# EAGLE design PressurePoints1X (EAGLE 9.2.0)
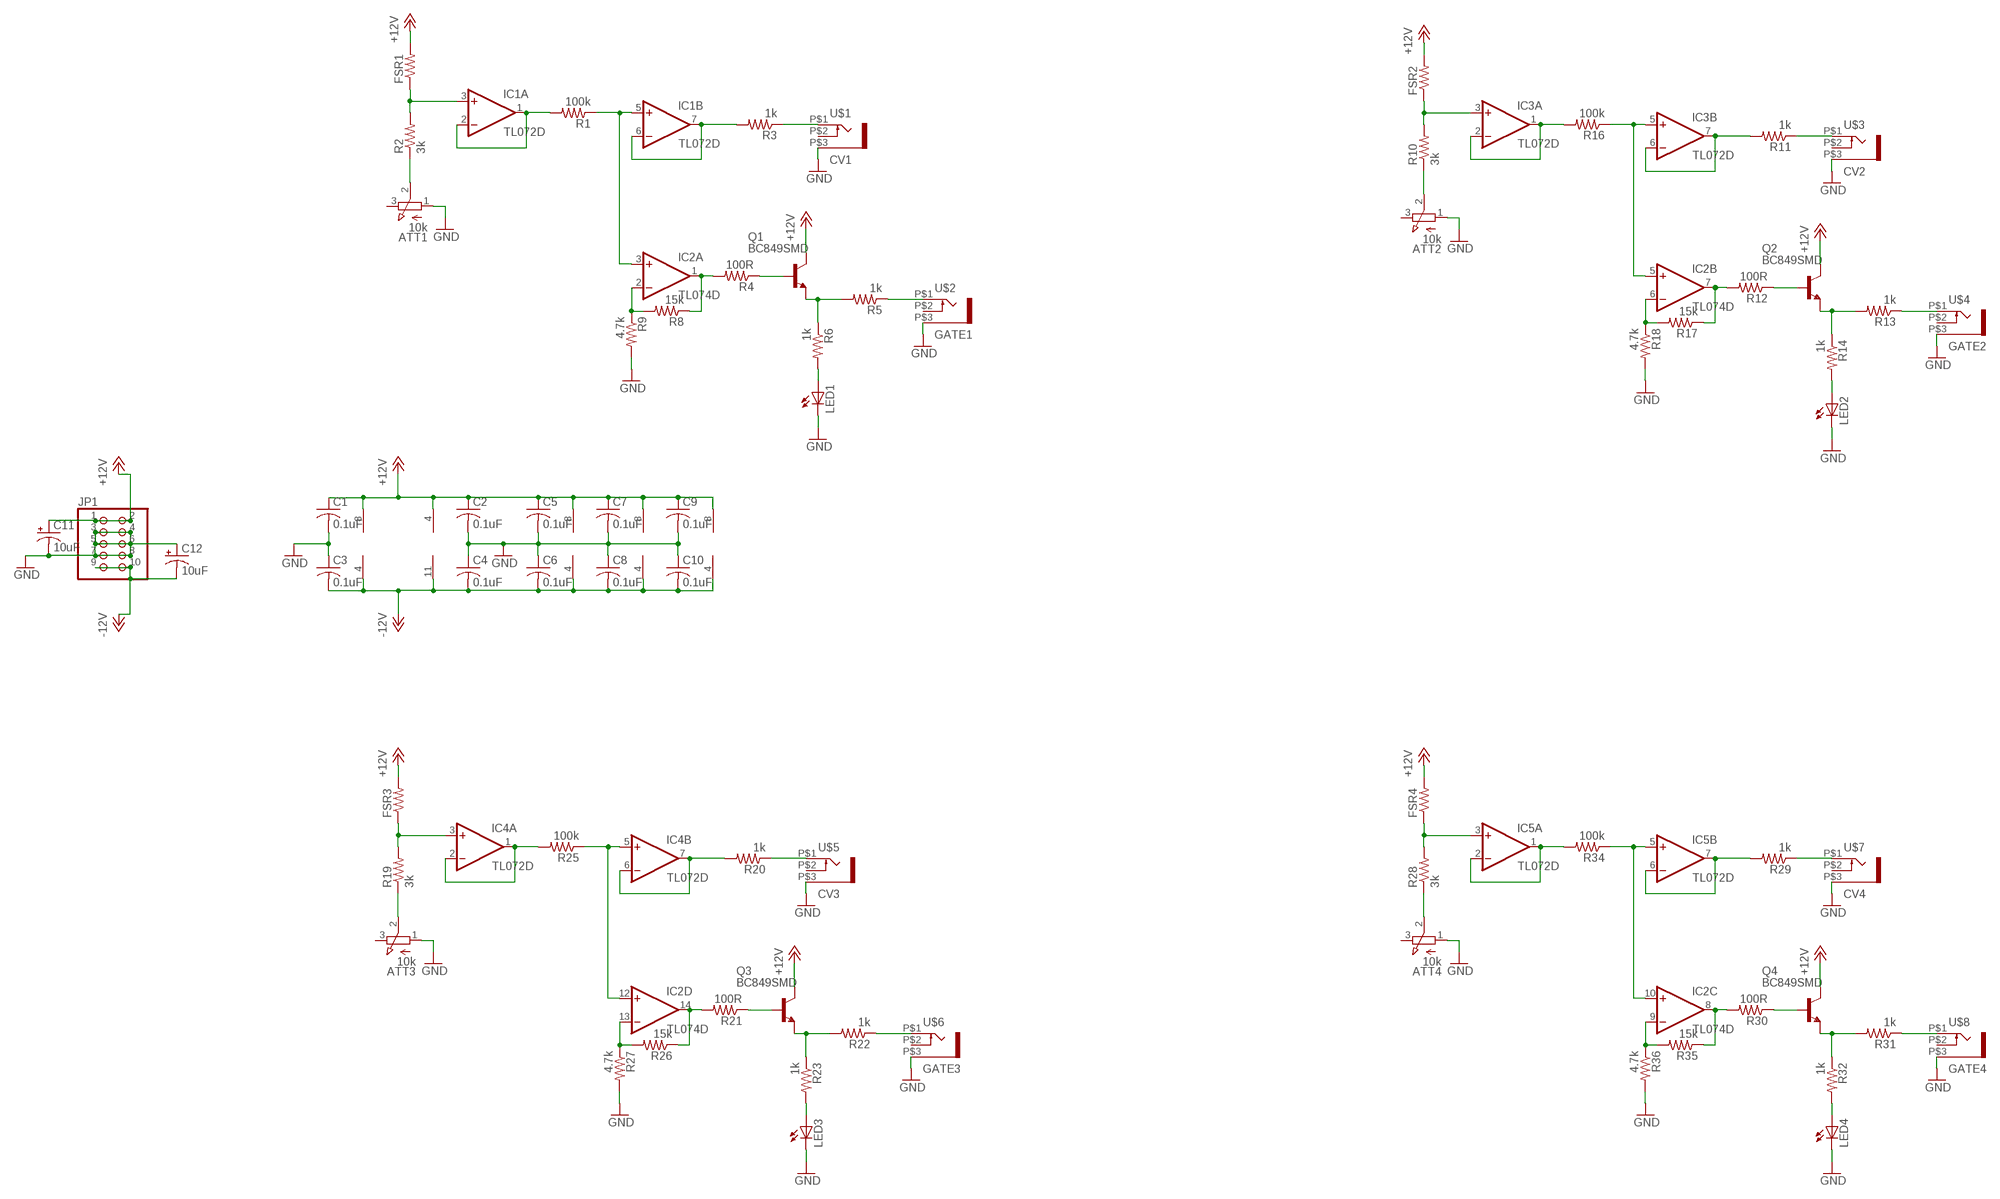
[diagram p0: schematic, sheet 1]

## Parts
ATT1  10k  EVUF2J  [EVUFXJ]
ATT2  10k  EVUF2J  [EVUFXJ]
ATT3  10k  EVUF2J  [EVUFXJ]
ATT4  10k  EVUF2J  [EVUFXJ]
C1  0.1uF  C-USC0603  [C0603]
C2  0.1uF  C-USC0603  [C0603]
C3  0.1uF  C-USC0603  [C0603]
C4  0.1uF  C-USC0603  [C0603]
C5  0.1uF  C-USC0603  [C0603]
C6  0.1uF  C-USC0603  [C0603]
C7  0.1uF  C-USC0603  [C0603]
C8  0.1uF  C-USC0603  [C0603]
C9  0.1uF  C-USC0603  [C0603]
C10  0.1uF  C-USC0603  [C0603]
C11  10uF  CPOL-USE2-5  [E2-5]
C12  10uF  CPOL-USE2-5  [E2-5]
FSR1  R-US_0207/2V  [0207/2V]
FSR2  R-US_0207/2V  [0207/2V]
FSR3  R-US_0207/2V  [0207/2V]
FSR4  R-US_0207/2V  [0207/2V]
IC1  TL072D  [SO08]
IC2  TL074D  [SO14]
IC3  TL072D  [SO08]
IC4  TL072D  [SO08]
IC5  TL072D  [SO08]
JP1  PINHD-2X5  [2X05]
LED1  LED3MM  [LED3MM]
LED2  LED3MM  [LED3MM]
LED3  LED3MM  [LED3MM]
LED4  LED3MM  [LED3MM]
Q1  BC849SMD  [SOT23-BEC]
Q2  BC849SMD  [SOT23-BEC]
Q3  BC849SMD  [SOT23-BEC]
Q4  BC849SMD  [SOT23-BEC]
R1  100k  R-US_R0603  [R0603]
R2  3k  R-US_R0603  [R0603]
R3  1k  R-US_R0603  [R0603]
R4  100R  R-US_R0603  [R0603]
R5  1k  R-US_R0603  [R0603]
R6  1k  R-US_R0603  [R0603]
R8  15k  R-US_R0603  [R0603]
R9  4.7k  R-US_R0603  [R0603]
R10  3k  R-US_R0603  [R0603]
R11  1k  R-US_R0603  [R0603]
R12  100R  R-US_R0603  [R0603]
R13  1k  R-US_R0603  [R0603]
R14  1k  R-US_R0603  [R0603]
R16  100k  R-US_R0603  [R0603]
R17  15k  R-US_R0603  [R0603]
R18  4.7k  R-US_R0603  [R0603]
R19  3k  R-US_R0603  [R0603]
R20  1k  R-US_R0603  [R0603]
R21  100R  R-US_R0603  [R0603]
R22  1k  R-US_R0603  [R0603]
R23  1k  R-US_R0603  [R0603]
R25  100k  R-US_R0603  [R0603]
R26  15k  R-US_R0603  [R0603]
R27  4.7k  R-US_R0603  [R0603]
R28  3k  R-US_R0603  [R0603]
R29  1k  R-US_R0603  [R0603]
R30  100R  R-US_R0603  [R0603]
R31  1k  R-US_R0603  [R0603]
R32  1k  R-US_R0603  [R0603]
R34  100k  R-US_R0603  [R0603]
R35  15k  R-US_R0603  [R0603]
R36  4.7k  R-US_R0603  [R0603]
U$1  CV1  WQP-PJ301M-12_JACK  [WQP-PJ301M-12_JACK]
U$2  GATE1  WQP-PJ301M-12_JACK  [WQP-PJ301M-12_JACK]
U$3  CV2  WQP-PJ301M-12_JACK  [WQP-PJ301M-12_JACK]
U$4  GATE2  WQP-PJ301M-12_JACK  [WQP-PJ301M-12_JACK]
U$5  CV3  WQP-PJ301M-12_JACK  [WQP-PJ301M-12_JACK]
U$6  GATE3  WQP-PJ301M-12_JACK  [WQP-PJ301M-12_JACK]
U$7  CV4  WQP-PJ301M-12_JACK  [WQP-PJ301M-12_JACK]
U$8  GATE4  WQP-PJ301M-12_JACK  [WQP-PJ301M-12_JACK]

## Nets
+12V: C1.1 C2.1 C5.1 C7.1 C9.1 C11.+ FSR1.2 FSR2.2 FSR3.2 FSR4.2 IC1.8(P:V+) IC2.4(P:V+) IC3.8(P:V+) IC4.8(P:V+) IC5.8(P:V+) JP1.1 JP1.2 Q1.C Q2.C Q3.C Q4.C
-12V: C3.2 C4.2 C6.2 C8.2 C10.2 C12.- IC1.4(P:V-) IC2.11(P:V-) IC3.4(P:V-) IC4.4(P:V-) IC5.4(P:V-) JP1.9 JP1.10
GND: ATT1.1(A) ATT2.1(A) ATT3.1(A) ATT4.1(A) C1.2 C2.2 C3.1 C4.1 C5.2 C6.1 C7.2 C8.1 C9.2 C10.1 C11.- C12.+ JP1.3 JP1.4 JP1.5 JP1.6 JP1.7 JP1.8 LED1.K(C) LED2.K(C) LED3.K(C) LED4.K(C) R9.2 R18.2 R27.2 R36.2 U$1.P$3 U$2.P$3 U$3.P$3 U$4.P$3 U$5.P$3 U$6.P$3 U$7.P$3 U$8.P$3
N$1: FSR1.1 IC1.3(A:+IN) R2.2
N$2: ATT1.2(S) R2.1
N$3: IC1.5(B:+IN) IC2.3(A:+IN) R1.1
N$4: IC1.6(B:-IN) IC1.7(B:OUT) R3.2
N$5: R3.1 U$1.P$1
N$6: Q1.E R5.2 R6.1
N$7: IC2.1(A:OUT) R4.2 R8.1
N$8: Q1.B R4.1
N$9: LED1.A R6.2
N$10: R5.1 U$2.P$1
N$11: IC1.1(A:OUT) IC1.2(A:-IN) R1.2
N$12: IC2.2(A:-IN) R8.2 R9.1
N$13: FSR2.1 IC3.3(A:+IN) R10.2
N$14: IC2.5(B:+IN) IC3.5(B:+IN) R16.1
N$15: IC3.6(B:-IN) IC3.7(B:OUT) R11.2
N$16: R11.1 U$3.P$1
N$17: IC2.7(B:OUT) R12.2 R17.1
N$18: Q2.B R12.1
N$19: LED2.A R14.2
N$20: Q2.E R13.2 R14.1
N$21: R13.1 U$4.P$1
N$22: ATT2.2(S) R10.1
N$23: IC3.1(A:OUT) IC3.2(A:-IN) R16.2
N$24: IC2.6(B:-IN) R17.2 R18.1
N$25: FSR3.1 IC4.3(A:+IN) R19.2
N$26: IC2.12(D:+IN) IC4.5(B:+IN) R25.1
N$27: IC4.6(B:-IN) IC4.7(B:OUT) R20.2
N$28: R20.1 U$5.P$1
N$29: IC2.14(D:OUT) R21.2 R26.1
N$30: Q3.B R21.1
N$31: LED3.A R23.2
N$32: Q3.E R22.2 R23.1
N$33: R22.1 U$6.P$1
N$34: ATT3.2(S) R19.1
N$35: IC4.1(A:OUT) IC4.2(A:-IN) R25.2
N$36: IC2.13(D:-IN) R26.2 R27.1
N$37: FSR4.1 IC5.3(A:+IN) R28.2
N$38: IC2.10(C:+IN) IC5.5(B:+IN) R34.1
N$39: IC5.6(B:-IN) IC5.7(B:OUT) R29.2
N$40: R29.1 U$7.P$1
N$41: IC2.8(C:OUT) R30.2 R35.1
N$42: Q4.B R30.1
N$43: LED4.A R32.2
N$44: Q4.E R31.2 R32.1
N$45: R31.1 U$8.P$1
N$46: ATT4.2(S) R28.1
N$47: IC5.1(A:OUT) IC5.2(A:-IN) R34.2
N$48: IC2.9(C:-IN) R35.2 R36.1
Unconnected: ATT1.3(E) ATT2.3(E) ATT3.3(E) ATT4.3(E) U$1.P$2 U$2.P$2 U$3.P$2 U$4.P$2 U$5.P$2 U$6.P$2 U$7.P$2 U$8.P$2

## Library data of the parts
ATT1-ATT4 = pot:EVU: 9 mm Square Rotary Potentiometers Source: Panasonic
C1-C10 = rcl:C-US: CAPACITOR, American symbol; SPICEPREFIX: C
C11 C12 = rcl:CPOL-US: POLARIZED CAPACITOR, American symbol; SPICEPREFIX: C
FSR1-FSR4 R1-R6 R8-R14 R16-R23 R25-R32 R34-R36 = rcl:R-US_: RESISTOR, American symbol; SPICEPREFIX: R
IC1 IC3-IC5 = linear:TL072: OP AMP
IC2 = linear:TL074: OP AMP
JP1 = pinhead:PINHD-2X5: PIN HEADER
LED1-LED4 = led:LED: LED OSRAM: - CHIPLED LG R971, LG N971, LY N971, LG Q971, LY Q971, LO R971, LY R971 LH N974, LH R974 LS Q976, LO Q976, LY Q976 LO Q996 - Hyper CHIPLED LW Q18S LB Q993, LB Q99A, LB R99A - SideLED LS A670, LO A670, LY A670, LG A670, LP A670 LB A673, LV A673, LT A673, LW A673 LH A674 LY A675 LS A676, LA A676, LO A676, LY A676, LW A676 LS A679, LY A679, LG A679 - Hyper Micro SIDELED® LS Y876, LA Y876, LO Y876, LY Y876 LT Y87S - SmartLED LW L88C, LW L88S LB L89C, LB L89S, LG L890 LS L89K, LO L89K, LY L89K LS L896, LA L896, LO L896, LY L896 - TOPLED LS T670, LO T670, LY T670, LG T670, LP T670 LSG T670, LSP T670, LSY T670, LOP T670, LYG T670 LG T671, LOG T671, LSG T671 LB T673, LV T673, LT T673, LW T673 LH T674 LS T676, LA T676, LO T676, LY T676, LB T676, LH T676, LSB T676, LW T676 LB T67C, LV T67C, LT T67C, LS T67K, LO T67K, LY T67K, LW E67C LS E67B, LA E67B, LO E67B, LY E67B, LB E67C, LV E67C, LT E67C LW T67C LS T679, LY T679, LG T679 LS T770, LO T770, LY T770, LG T770, LP T770 LB T773, LV T773, LT T773, LW T773 LH T774 LS E675, LA E675, LY E675, LS T675 LS T776, LA T776, LO T776, LY T776, LB T776 LHGB T686 LT T68C, LB T68C - Hyper Mini TOPLED® LB M676 - Mini TOPLED Santana® LG M470 LS M47K, LO M47K, LY M47K Source: http://www.osram.convergy.de LUXEON: - LUMILED® LXK2-PW12-R00, LXK2-PW12-S00, LXK2-PW14-U00, LXK2-PW14-V00 LXK2-PM12-R00, LXK2-PM12-S00, LXK2-PM14-U00 LXK2-PE12-Q00, LXK2-PE12-R00, LXK2-PE12-S00, LXK2-PE14-T00, LXK2-PE14-U00 LXK2-PB12-K00, LXK2-PB12-L00, LXK2-PB12-M00, LXK2-PB14-N00, LXK2-PB14-P00, LXK2-PB14-Q00 LXK2-PR12-L00, LXK2-PR12-M00, LXK2-PR14-Q00, LXK2-PR14-R00 LXK2-PD12-Q00, LXK2-PD12-R00, LXK2-PD12-S00 LXK2-PH12-R00, LXK2-PH12-S00 LXK2-PL12-P00, LXK2-PL12-Q00, LXK2-PL12-R00 Source: www.luxeon.com KINGBRIGHT: KA-3528ASYC Source: www.kingbright.com
Q1-Q4 = transistor-npn:BC849*: NPN Transistor
U$1-U$8 = thonkiconn:WQP-PJ301M-12_JACK

## Board
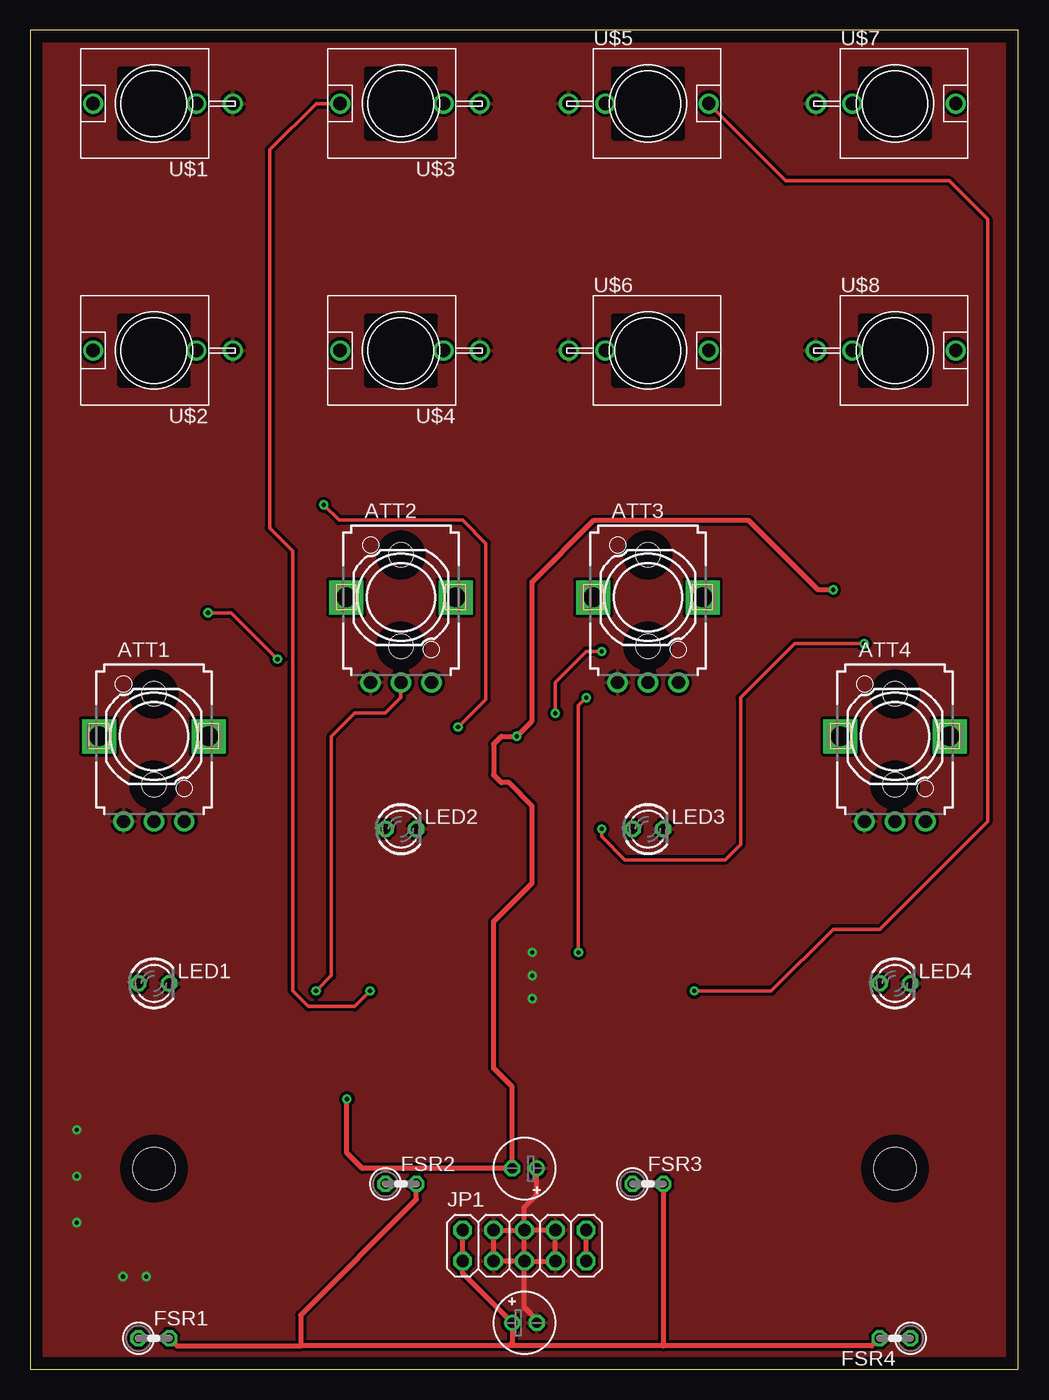
[diagram p1: board, top side]
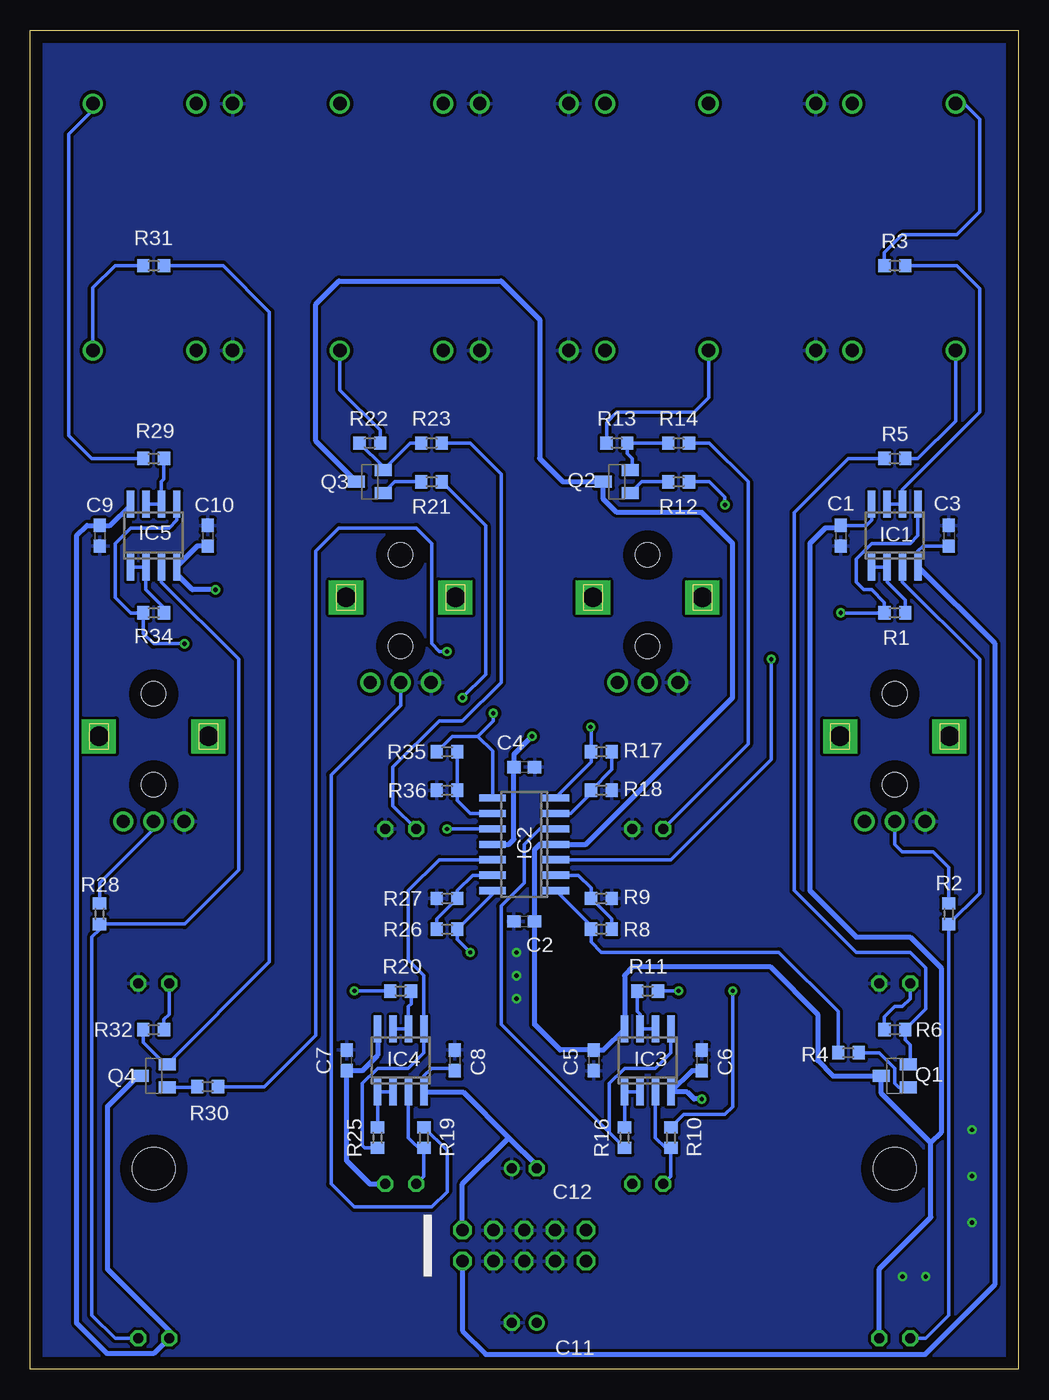
[diagram p2: board, bottom side, seen from below]

Size 81.26 x 110.16 mm. Coordinates in mm from the lower left corner, seen from the top.
Outline: 0,0 81.26,0 81.26,110.16 0,110.16 0,0
Copper layers (1*16): Top 0.035mm / dielectric 1.5mm / Bottom 0.035mm
Design rules "default": minimum track width 6mil, minimum drill 0.35mm, track to track 6mil, track to pad 6mil, pad to pad 6mil, via to via 6mil, smd to smd 6mil, copper to edge 40mil, drill to drill 6mil, minimum pad ring 10mil, minimum via ring 8mil, stop-mask expansion 4mil, vias tented up to drill 0mil, thermal gap 10mil
Holes 3.5 mm at 10.16,16.51 71.12,16.51

### Footprints (pad centres in the part's own frame; a part is rotated, then mirrored left to right if it is on the bottom)
EVUFXJ = drill 1.1 pad 1.676: 1 -2.5,-7; 2 0,-7; 3 2.5,-7 | drill 1.6 pad 2.8 square: M1 4.5,0; M2 -4.5,0 | hole 2: 0,3.5; 0,-4
C0603 = smd 1.1 x 1: 1 -0.85,0; 2 0.85,0
E2-5 = drill 0.813 pad 1.27: + -1.016,0 | drill 0.813 pad 1.27 octagon: - 1.016,0
0207/2V = drill 0.813 octagon: 1 -1.27,0; 2 1.27,0
SO08 = smd 0.6 x 2.2: 1 -1.905,-2.6; 2 -0.635,-2.6; 3 0.635,-2.6; 4 1.905,-2.6; 5 1.905,2.6; 6 0.635,2.6; 7 -0.635,2.6; 8 -1.905,2.6
SO14 = smd 0.6 x 2.2: 1 -3.81,-2.6; 2 -2.54,-2.6; 3 -1.27,-2.6; 4 0,-2.6; 5 1.27,-2.6; 6 2.54,-2.6; 7 3.81,-2.6; 8 3.81,2.6; 9 2.54,2.6; 10 1.27,2.6; 11 0,2.6; 12 -1.27,2.6; 13 -2.54,2.6; 14 -3.81,2.6
2X05 = drill 1.016 octagon: 1 -5.08,-1.27; 2 -5.08,1.27; 3 -2.54,-1.27; 4 -2.54,1.27; 5 0,-1.27; 6 0,1.27; 7 2.54,-1.27; 8 2.54,1.27; 9 5.08,-1.27; 10 5.08,1.27
LED3MM = drill 0.813 octagon: A -1.27,0; K 1.27,0
SOT23-BEC = smd 1 x 1.4: B -0.95,-1.1; C 0,1.1; E 0.95,-1.1
R0603 = smd 1 x 1.1: 1 -0.85,0; 2 0.85,0
WQP-PJ301M-12_JACK = drill 1.1: P$1 0,5; P$2 0,-3.5; P$3 0,-6.5

### Placement (x,y rotation side)
ATT1  10.16,52.07 0 top
ATT2  30.48,63.5 0 top
ATT3  50.8,63.5 0 top
ATT4  71.12,52.07 0 top
C1  14.61,68.58 270 bottom
C2  40.64,36.83 180 bottom
C3  5.71,68.58 270 bottom
C4  40.64,49.53 180 bottom
C5  34.92,25.4 270 bottom
C6  26.04,25.4 270 bottom
C7  55.24,25.4 90 bottom
C8  46.35,25.4 270 bottom
C9  75.56,68.58 270 bottom
C10  66.67,68.58 270 bottom
C11  40.64,3.81 0 top
C12  40.64,16.51 180 top
FSR1  10.16,2.54 0 top
FSR2  30.48,15.24 0 top
FSR3  50.8,15.24 0 top
FSR4  71.12,2.54 180 top
IC1  10.16,68.58 0 bottom
IC2  40.64,43.18 90 bottom
IC3  30.48,25.4 0 bottom
IC4  50.8,25.4 0 bottom
IC5  71.12,68.58 0 bottom
JP1  40.64,10.16 0 top
LED1  10.16,31.75 0 top
LED2  30.48,44.45 0 top
LED3  50.8,44.45 0 top
LED4  71.12,31.75 0 top
Q1  10.16,24.13 90 bottom
Q2  33.02,73.03 90 bottom
Q3  53.34,73.03 90 bottom
Q4  71.12,24.13 90 bottom
R1  10.16,62.23 0 bottom
R2  5.71,37.47 270 bottom
R3  10.16,90.81 0 bottom
R4  13.97,26.04 180 bottom
R5  10.16,74.93 180 bottom
R6  10.16,27.94 180 bottom
R8  34.29,36.2 0 bottom
R9  34.29,38.73 0 bottom
R10  28.57,19.05 270 bottom
R11  30.48,31.11 180 bottom
R12  27.94,73.03 0 bottom
R13  33.02,76.2 0 bottom
R14  27.94,76.2 0 bottom
R16  32.38,19.05 90 bottom
R17  34.29,50.8 0 bottom
R18  34.29,47.62 0 bottom
R19  48.9,19.05 270 bottom
R20  50.8,31.11 0 bottom
R21  48.26,73.03 0 bottom
R22  53.34,76.2 180 bottom
R23  48.26,76.2 0 bottom
R25  52.7,19.05 90 bottom
R26  46.99,36.2 180 bottom
R27  46.99,38.73 180 bottom
R28  75.56,37.47 270 bottom
R29  71.12,74.93 0 bottom
R30  66.67,23.24 0 bottom
R31  71.12,90.81 0 bottom
R32  71.12,27.94 0 bottom
R34  71.12,62.23 0 bottom
R35  46.99,50.8 0 bottom
R36  46.99,47.62 180 bottom
U$1  10.16,104.14 90 top
U$2  10.16,83.82 90 top
U$3  30.48,104.14 90 top
U$4  30.48,83.82 90 top
U$5  50.8,104.14 270 top
U$6  50.8,83.82 270 top
U$7  71.12,104.14 270 top
U$8  71.12,83.82 270 top

### Tracks (layer width: path | path; a pad name or v marks a point on that pad's centre or on a via)
+12V
  Top 0.406: 22.23,1.91 22.23,4.45 31.75,13.97 FSR2.2 | FSR1.2 12.06,1.91 22.23,1.91 | FSR3.2 52.07,1.91 | 52.07,1.91 39.37,1.91 | 39.37,1.91 22.23,1.91 | FSR4.2 69.22,1.91 52.07,1.91 | JP1.2 JP1.1 35.56,7.87 C11.+ 39.62,2.16 39.37,1.91
  Bottom 0.305: IC1.8 12.06,69.85 12.48,69.43 C1.1
  Bottom 0.406: 7.19,18.62 7.19,12.49 11.43,8.26 FSR1.2 | 7.19,18.62 11.26,22.69 Q1.C 15.24,24.13 16.51,25.4 16.51,29.21 20.42,33.12 31.65,33.12 32.38,32.38 IC3.8 34.13,26.25 C5.1 37.68,26.25 39.79,28.36 C2.1 39.79,42.76 39.37,43.18 IC2.4 35.56,43.18 23.5,55.24 23.5,67.94 26.04,70.48 33.02,70.48 34.12,71.58 Q2.C 37.47,73.03 39.37,74.93 39.37,86.36 42.55,89.53 55.88,89.53 57.78,87.63 57.78,76.37 Q3.C | FSR3.2 53.34,15.24 55.24,17.14 C7.1 53.98,24.55 52.7,25.82 IC4.8 | Q4.C 72.39,24.13 74.93,21.59 74.93,8.26 69.85,3.17 FSR4.2 71.12,1.27 74.93,1.27 77.47,3.81 77.47,68.58 76.62,69.43 C9.1 74.72,69.43 73.03,71.12 IC5.8 | C1.1 14.82,69.22 15.88,69.22 17.14,67.94 17.14,39.37 13.34,35.56 8.89,35.56 6.35,33.02 6.35,19.46 7.19,18.62
-12V  (via drill 0.35)
  Top 0.406: JP1.9 JP1.10 | v26.04,22.23 26.04,17.78 27.3,16.51 C12.- 39.62,23.24 38.1,24.77 38.1,36.83 41.27,40.01 41.27,46.35 39.37,48.26 38.73,48.26 38.1,48.9 38.1,51.44 38.73,52.07 v40.01,52.07 41.27,53.34 41.27,64.77 46.35,69.85 59.05,69.85 64.77,64.14 v66.04,64.14
  Bottom 0.305: IC1.4 8.26,66.04 8.26,67.31 7.83,67.73 C3.2 | 28.57,23.5 IC3.4 | C8.2 46.57,24.77 48.26,24.77 48.9,24.13 IC4.4
  Bottom 0.406: IC4.4 45.66,22.8 41.91,19.05 | 41.91,19.05 39.62,16.76 C12.- | IC2.11 41.91,43.18 41.49,43.6 C4.2 41.49,50.59 v40.01,52.07 | v26.04,22.23 26.67,22.23 27.25,22.8 IC3.4 26.82,24.55 C6.2 | v66.04,64.14 67.94,64.14 69.22,65.41 IC5.4 69.22,66.04 67.53,67.73 C10.2 | JP1.10 45.72,15.24 41.91,19.05 | JP1.9 45.72,3.17 43.81,1.27 43.81,1.22 7.67,1.22 1.91,6.99 1.91,59.69 8.26,66.04
GND  (via drill 0.35)
  Top 0.406: JP1.6 JP1.8 JP1.7 JP1.5 | JP1.6 JP1.4 JP1.3 JP1.5 | JP1.5 JP1.6 | C11.- 41.66,4.06 40.64,5.08 JP1.5 | JP1.6 40.64,13.34 41.66,14.35 C12.+
  other vias: 9.53,7.62 7.62,7.62 3.81,12.06 3.81,15.88 3.81,19.68 41.27,30.48 41.27,32.38 41.27,34.29
  pour Bottom (isolate 0.254): 0,109.22 81.28,109.22 81.28,-0.64 0,-0.64
  pour Top (isolate 0.254): 0,109.86 81.28,109.86 81.28,0 0,0
N$1
  Bottom 0.305: FSR1.1 7.62,2.54 5.71,4.45 R2.2 3.17,39.16 3.17,58.42 9.53,64.77 IC1.3
N$2
  Bottom 0.305: R2.1 5.71,41.27 6.99,42.55 9.53,42.55 10.16,43.18 ATT1.2
N$3  (via drill 0.35)
  Top 0.305: v14.61,62.23 16.51,62.23 v20.32,58.42
  Bottom 0.305: v20.32,58.42 20.32,50.16 28.57,41.91 IC2.3 | IC1.5 8.26,68.58 8.89,67.94 12.06,67.94 13.34,66.67 13.34,64.77 12.7,64.14 12.06,64.14 11.01,63.08 R1.1 v14.61,62.23
N$4
  Bottom 0.305: IC1.7 IC1.6 9.53,72.39 3.17,78.74 3.17,88.9 5.08,90.81 R3.2
N$5
  Bottom 0.305: U$1.P$1 4.45,104.14 3.17,102.87 3.17,95.25 5.08,93.34 9.53,93.34 11.01,91.86 R3.1
N$6
  Bottom 0.305: Q1.E 8.89,25.25 8.89,26.67 9.31,27.09 R6.1 7.62,29.63 7.62,33.02 8.89,34.29 13.34,34.29 18.41,39.37 18.41,70.48 13.97,74.93 R5.2
N$7
  Bottom 0.305: IC2.1 35.14,36.47 R8.1 35.14,35.14 34.29,34.29 19.68,34.29 14.82,29.43 R4.2
N$8
  Bottom 0.305: R4.1 11.43,26.04 10.16,24.77 10.16,23.5 9.85,23.18 Q1.B
N$9
  Bottom 0.305: R6.2 11.01,29 10.16,29.84 9.53,29.84 8.89,30.48 LED1.A
N$10
  Bottom 0.305: U$2.P$1 5.16,78.03 8.26,74.93 R5.1
N$11
  Bottom 0.305: IC1.1 IC1.2 10.79,64.77 9.31,63.28 R1.2
N$12
  Bottom 0.305: R8.2 33.44,37.03 R9.1 35.14,39.59 36.2,40.64 IC2.2
N$13
  Bottom 0.305: FSR2.1 28.57,15.88 R10.2 29,18.2 29.84,19.05 IC3.3
N$14
  Bottom 0.305: IC3.5 28.57,26.04 29.84,24.77 32.38,24.77 33.66,23.5 33.66,19.47 | R16.1 33.66,19.47 | 33.66,19.47 42.55,28.36 42.55,38.1 40.64,40.01 40.64,43.18 39.37,44.45 IC2.5
N$15
  Bottom 0.305: IC3.6 IC3.7 31.11,29.21 31.33,29.43 R11.2
N$16  (via drill 0.35)
  Top 0.305: v27.94,31.11 26.67,29.84 22.86,29.84 21.59,31.11 21.59,67.31 19.68,69.22 19.68,100.33 23.5,104.14 U$3.P$1
  Bottom 0.305: v27.94,31.11 R11.1
N$17  (via drill 0.35)
  Top 0.305: v35.18,52.83 37.47,55.12 37.47,67.94 35.56,69.85 25.4,69.85 v24.13,71.12
  Bottom 0.305: IC2.7 38.04,47.05 35.14,49.95 R17.1 35.14,52.79 v35.18,52.83 | R12.2 25.4,73.03 24.13,71.75 v24.13,71.12
N$18
  Bottom 0.305: Q2.B 30.97,73.03 R12.1
N$19
  Bottom 0.305: LED2.A 22.23,51.44 22.23,73.03 25.4,76.2 R14.2
N$20
  Bottom 0.305: R14.1 R13.2 32.17,75.35 31.75,74.93 31.75,74.14 Q2.E
N$21
  Bottom 0.305: R13.1 33.87,77.89 33.02,78.74 26.67,78.74 25.48,79.93 U$4.P$1
N$22  (via drill 0.35)
  Top 0.305: v23.5,31.11 24.77,32.38 24.77,52.07 26.67,53.98 29.21,53.98 30.48,55.24 ATT2.2
  Bottom 0.305: R10.1 27.52,20.95 24.13,20.95 23.5,21.59 v23.5,31.11
N$23
  Bottom 0.305: IC3.2 IC3.1 R16.2
N$24
  Bottom 0.305: IC2.6 36.83,45.72 35.14,47.41 R18.1 33.44,49.33 R17.2
N$25
  Bottom 0.305: FSR3.1 48.9,15.88 48.9,17.78 | 48.9,17.78 R19.2 | IC4.3 50.16,19.05 48.9,17.78
N$26
  Bottom 0.305: R25.1 53.76,18.2 53.98,18.41 53.98,23.5 52.7,24.77 50.16,24.77 48.9,26.04 IC4.5 48.9,32.38 50.16,33.66 50.16,39.37 47.62,41.91 IC2.12
N$27
  Bottom 0.305: R20.2 49.95,30.06 50.16,29.84 IC4.6 IC4.7
N$28  (via drill 0.35)
  Top 0.305: U$5.P$1 62.15,97.79 75.56,97.79 78.74,94.61 78.74,45.09 69.85,36.2 66.04,36.2 60.96,31.11 v54.61,31.11
  Bottom 0.305: R20.1 v54.61,31.11
N$29  (via drill 0.35)
  Top 0.305: v45.09,34.29 45.09,54.61 v45.72,55.24
  Bottom 0.305: IC2.14 43.24,39.09 R26.1 46.14,35.34 v45.09,34.29 | R21.2 43.81,69.43 43.81,57.15 v45.72,55.24
N$30
  Bottom 0.305: Q3.B 51.29,73.03 R21.1
N$31
  Bottom 0.305: R23.2 45.09,76.2 42.55,73.66 42.55,56.52 45.72,53.34 47.62,53.34 51.44,49.53 51.44,46.35 LED3.A
N$32
  Bottom 0.305: R22.2 52.24,74.25 Q3.E 50.02,76.2 R23.1
N$33
  Bottom 0.305: U$6.P$1 55.8,80.56 52.49,77.25 R22.1
N$34
  Bottom 0.305: R19.1 46.99,18 46.99,14.61 48.26,13.34 54.61,13.34 56.52,15.24 56.52,48.9 50.8,54.61 ATT3.2
N$35
  Bottom 0.305: IC4.2 IC4.1 R25.2
N$36
  Bottom 0.305: IC2.13 44.87,40.64 46.14,39.37 R27.1 47.84,37.03 R26.2
N$37
  Bottom 0.305: IC5.3 70.48,64.77 64.14,58.42 64.14,41.06 68.58,36.62 R28.2 75.56,36.2 76.2,35.56 76.2,4.45 74.3,2.54 FSR4.1
N$38  (via drill 0.35)
  Top 0.305: v68.58,59.69 62.87,59.69 58.42,55.24 58.42,43.18 57.15,41.91 48.9,41.91 46.99,43.81 v46.99,44.45
  Bottom 0.305: IC5.5 69.22,69.85 69.85,69.22 73.03,69.22 74.3,67.94 74.3,63.5 73.03,62.23 R34.1 71.97,60.54 71.12,59.69 v68.58,59.69 | v46.99,44.45 IC2.10
N$39
  Bottom 0.305: IC5.7 IC5.6 70.48,73.03 70.27,73.24 R29.2
N$40
  Bottom 0.305: U$7.P$1 76.12,103.58 78.11,101.6 78.11,76.83 76.2,74.93 R29.1
N$41  (via drill 0.35)
  Top 0.305: v46.99,59.05 45.72,59.05 43.18,56.52 v43.18,53.98
  Bottom 0.305: R35.1 46.57,52.07 44.45,52.07 | 44.45,52.07 43.24,50.86 IC2.8 | R30.2 62.02,23.24 57.78,27.47 57.78,67.31 55.88,69.22 49.53,69.22 48.26,67.94 48.26,59.69 47.62,59.05 v46.99,59.05 | v43.18,53.98 43.18,53.34 44.45,52.07
N$42
  Bottom 0.305: Q4.B 67.59,23.18 R30.1
N$43
  Bottom 0.305: R32.2 70.27,28.79 69.85,29.21 LED4.A
N$44
  Bottom 0.305: R32.1 71.97,26.89 70.17,25.08 Q4.E 61.59,33.51 61.59,87 65.41,90.81 R31.2
N$45
  Bottom 0.305: U$8.P$1 76.12,88.98 74.3,90.81 R31.1
N$46
  Bottom 0.305: R28.1 75.56,40.01 71.12,44.45 ATT4.2
N$47
  Bottom 0.305: IC5.1 IC5.2 71.75,64.14 70.27,62.65 R34.2
N$48
  Bottom 0.305: R35.2 R36.1 46.14,46.77 45.09,45.72 IC2.9